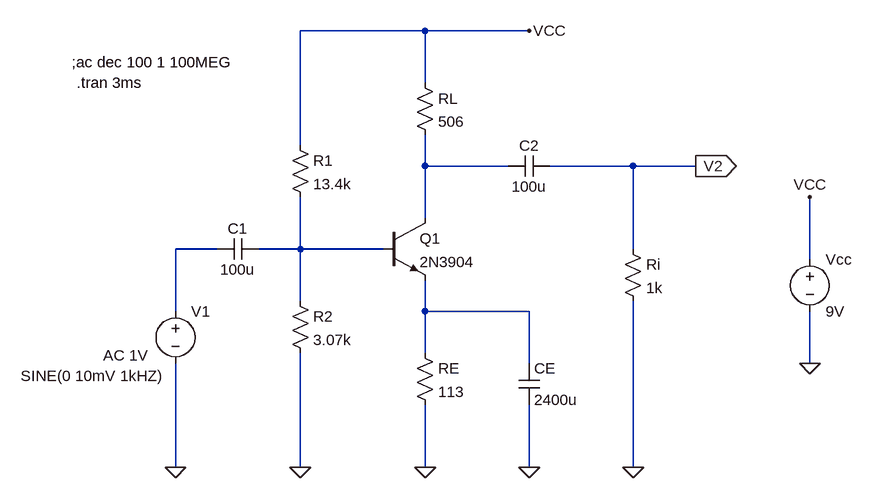
[diagram p0: schematic kouryubias.asc]
kouryubias.asc, the LTspice schematic file:
Version 4
SHEET 1 932 680
WIRE 272 -192 80 -192
WIRE 432 -192 272 -192
WIRE 272 -112 272 -192
WIRE 80 -16 80 -192
WIRE 272 16 272 -32
WIRE 400 16 272 16
WIRE 592 16 464 16
WIRE 688 16 592 16
WIRE 272 96 272 16
WIRE -48 144 -112 144
WIRE 80 144 80 64
WIRE 80 144 16 144
WIRE 208 144 80 144
WIRE 592 144 592 16
WIRE 864 160 864 64
WIRE 80 224 80 144
WIRE -112 240 -112 144
WIRE 272 240 272 192
WIRE 432 240 272 240
WIRE 272 304 272 240
WIRE 432 320 432 240
WIRE 864 320 864 240
WIRE -112 480 -112 320
WIRE 80 480 80 304
WIRE 272 480 272 384
WIRE 432 480 432 384
WIRE 592 480 592 224
FLAG 272 480 0
FLAG 432 480 0
FLAG 592 480 0
FLAG 80 480 0
FLAG 688 16 V2
IOPIN 688 16 Out
FLAG 432 -192 VCC
FLAG 864 320 0
FLAG 864 64 VCC
FLAG -112 480 0
DATAFLAG 464 -192 ""
SYMBOL npn 208 96 R0
SYMATTR InstName Q1
SYMATTR Value 2N3904
SYMBOL res 64 -32 R0
SYMATTR InstName R1
SYMATTR Value 13.4k
SYMBOL res 256 -128 R0
SYMATTR InstName RL
SYMATTR Value 506
SYMBOL res 64 208 R0
SYMATTR InstName R2
SYMATTR Value 3.07k
SYMBOL res 256 288 R0
SYMATTR InstName RE
SYMATTR Value 113
SYMBOL cap 464 0 R90
WINDOW 0 0 32 VBottom 2
WINDOW 3 32 32 VTop 2
SYMATTR InstName C2
SYMATTR Value 100u
SYMBOL res 576 128 R0
SYMATTR InstName Ri
SYMATTR Value 1k
SYMBOL cap 416 320 R0
SYMATTR InstName CE
SYMATTR Value 2400u
SYMBOL voltage 864 144 R0
SYMATTR InstName Vcc
SYMATTR Value 9V
SYMBOL cap 16 128 R90
WINDOW 0 0 32 VBottom 2
WINDOW 3 32 32 VTop 2
SYMATTR InstName C1
SYMATTR Value 100u
SYMBOL voltage -112 224 R0
WINDOW 3 -238 115 Left 2
WINDOW 123 -111 84 Left 2
WINDOW 39 0 0 Left 0
SYMATTR Value SINE(0 10mV 1kHZ)
SYMATTR Value2 AC 1V
SYMATTR InstName V1
TEXT -272 -144 Left 2 !;ac dec 100 1 100MEG
TEXT -264 -112 Left 2 !.tran 3ms

The netlist it stands for:
* kouryubias.asc
Q1 N001 N003 N004 0 2N3904
R1 VCC N003 13.4k
RL VCC N001 506
R2 N003 0 3.07k
RE N004 0 113
C2 V2 N001 100u
Ri V2 0 1k
CE N004 0 2400u
Vcc VCC 0 9V
C1 N003 N002 100u
V1 N002 0 SINE(0 10mV 1kHZ) AC 1V
.model NPN NPN
.model PNP PNP
.lib standard.bjt
;ac dec 100 1 100MEG
.tran 3ms
.backanno
.end